# EasyEDA schematic Jafar - EasyEDA - Schematic Export.json
TITLE: Jafar Chip; REV: 5.0; Date: 09-11-2024; Sheet: 1/1; Drawn By: Tony Kuberka; Company: TK's Custom Super Modz LLC
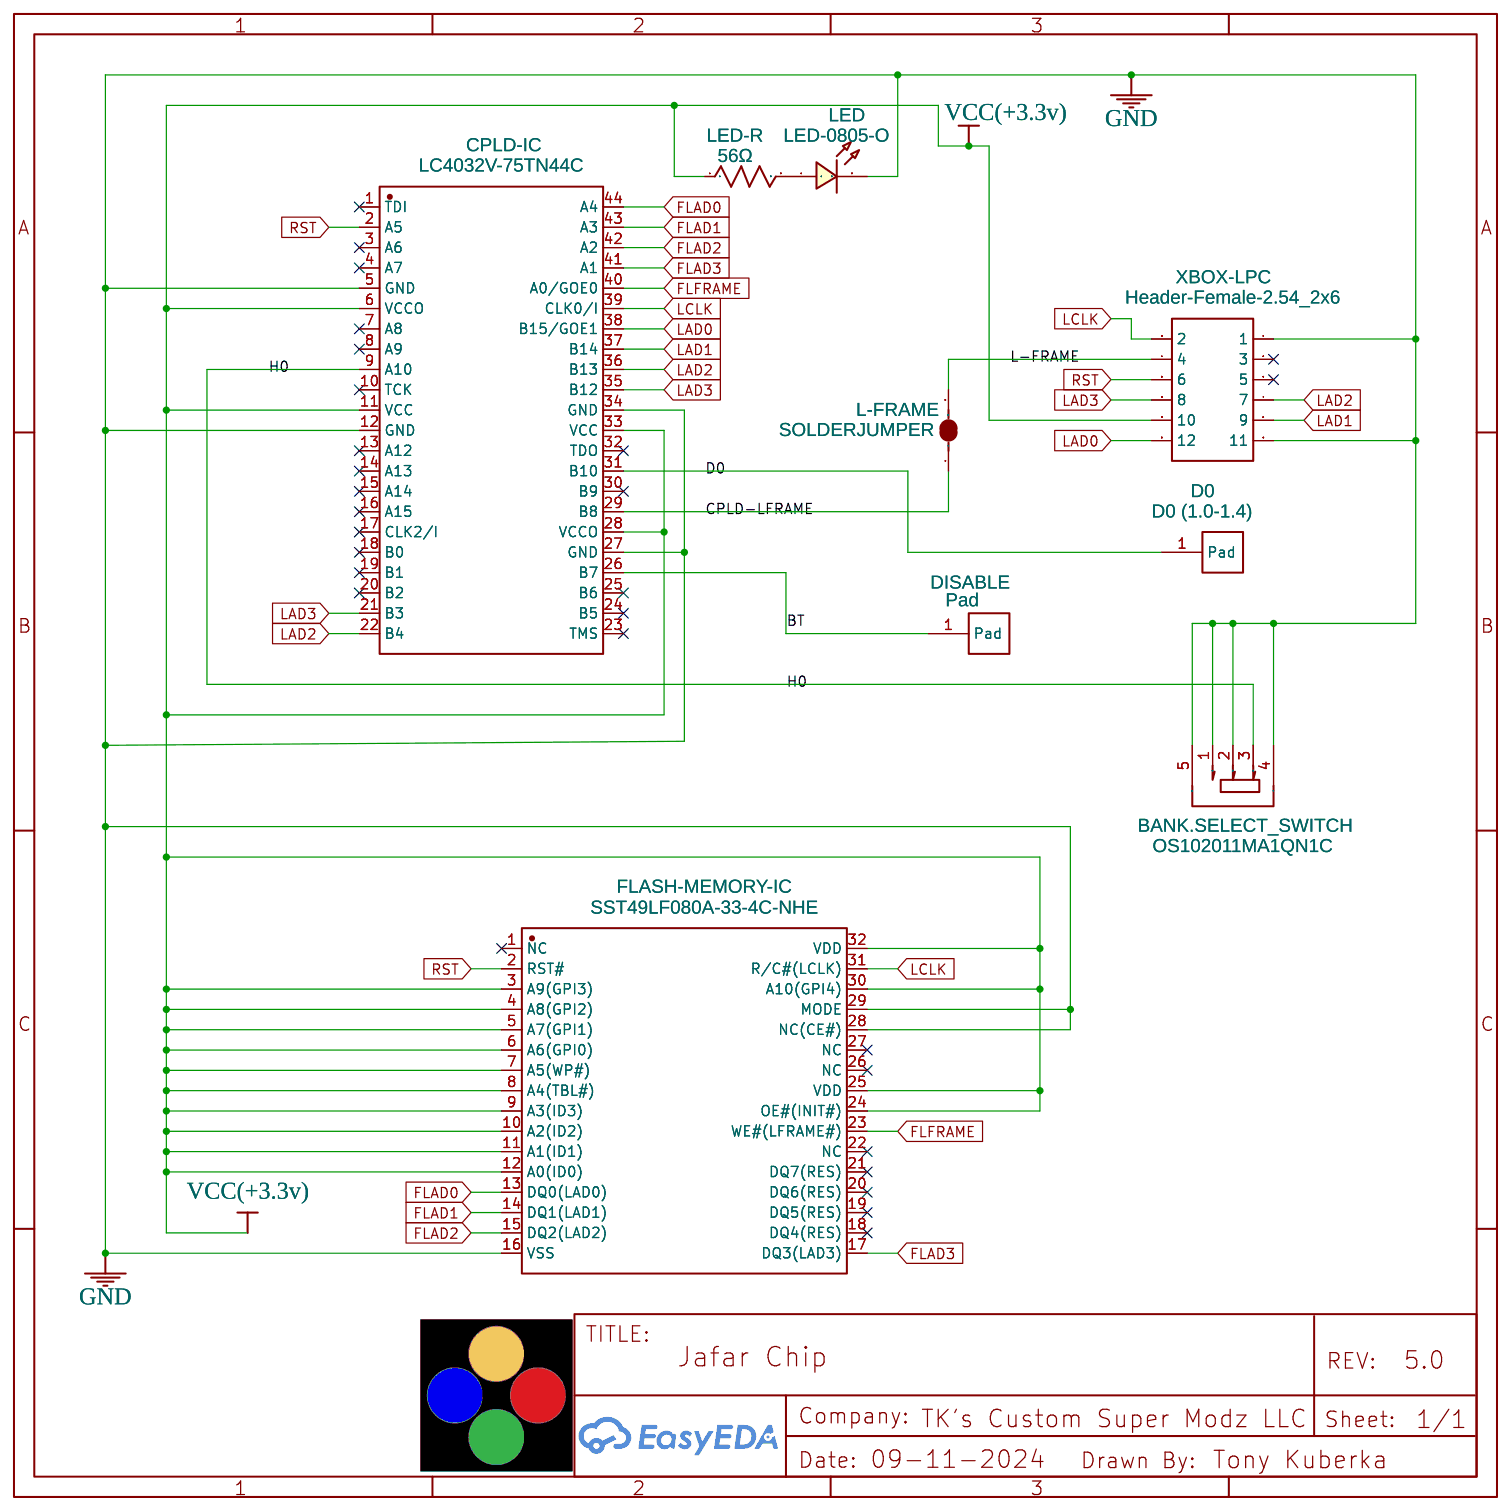
[diagram p0: schematic sheet]

## Parts
BANK.SELECT_SWITCH  OS102011MA1QN1C  [SW-TH_OS102011MA1QN1C]
CPLD-IC  LC4032V-75TN44C  [TQFP-44_L10.0-W10.0-P0.80-LS12.0-BL]
D0  D0 (1.0-1.4)  [PADPAD]
DISABLE  Pad  [PADPAD]
FLASH-MEMORY-IC  SST49LF080A-33-4C-NHE  [PLCC-32_L14.0-W11.4-P1.27-LS15.0-T]
L-FRAME  SOLDERJUMPER  [SJ_2S-NOTRACE]
LED  LED-0805-O  [LED-0805-ORANGE]
LED-R  56Ω  [R0805]
XBOX-LPC  Header-Female-2.54_2x6  [HDR-TH_12P-P2.54-V-F-R2-C6-S2.54]

## Library data of the parts
BANK.SELECT_SWITCH = OS102011MA1QN1C: Supplier: LCSC; Supplier Part: C221828; Manufacturer: C&K; Contributor: LCSC; JLCPCB Part Class: Extended Part
CPLD-IC = LC4032V-75TN44C: Supplier: LCSC; Supplier Part: C1521108; Manufacturer: LATTICE(莱迪思); Contributor: LCSC; JLCPCB Part Class: Extended Part
D0 DISABLE = SOLDER PAD: Contributor: Tellon
FLASH-MEMORY-IC = SST49LF080A-33-4C-NHE: Supplier: LCSC; Supplier Part: C645941; Manufacturer: MICROCHIP(美国微芯); link: https://atta.szlcsc.comnull; Contributor: lcsc
L-FRAME = SOLDERJUMPER-OLDNC2: Solder Jumper; Contributor: SparkFun
LED = LED-0805-ORANGE: Manufacturer: Yongyu Photoelectric; Manufacturer Part: SZYY0805O; Supplier: LCSC; Supplier Part: C434437; link: https://datasheet.lcsc.com/lcsc/1912111437_Yongyu-Photoelectric-SZYY0805O_C434437.pdf; Contributor: ajkuberka; Package Display: No
LED-R = R_0805_US: Contributor: LCEDA_Lib
XBOX-LPC = Header-Female-2.54_2x6: Supplier: LCSC; Manufacturer: BOOMELE(博穆精密); Manufacturer Part: 2.54-2*6P母; Supplier Part: C36191; JLCPCB Part Class: Extended Part

## Nets
GND: BANK.SELECT_SWITCH.1 BANK.SELECT_SWITCH.2 BANK.SELECT_SWITCH.4 BANK.SELECT_SWITCH.5 CPLD-IC.5(GND) CPLD-IC.12(GND) CPLD-IC.27(GND) CPLD-IC.34(GND) FLASH-MEMORY-IC.16(VSS) FLASH-MEMORY-IC.28(NC(CE#)) FLASH-MEMORY-IC.29(MODE) LED.2 XBOX-LPC.1 XBOX-LPC.11
VCC(+3.3v): CPLD-IC.6(VCCO) CPLD-IC.11(VCC) CPLD-IC.28(VCCO) CPLD-IC.33(VCC) FLASH-MEMORY-IC.3(A9(GPI3)) FLASH-MEMORY-IC.4(A8(GPI2)) FLASH-MEMORY-IC.5(A7(GPI1)) FLASH-MEMORY-IC.6(A6(GPI0)) FLASH-MEMORY-IC.7(A5(WP#)) FLASH-MEMORY-IC.8(A4(TBL#)) FLASH-MEMORY-IC.9(A3(ID3)) FLASH-MEMORY-IC.10(A2(ID2)) FLASH-MEMORY-IC.11(A1(ID1)) FLASH-MEMORY-IC.12(A0(ID0)) FLASH-MEMORY-IC.24(OE#(INIT#)) FLASH-MEMORY-IC.25(VDD) FLASH-MEMORY-IC.30(A10(GPI4)) FLASH-MEMORY-IC.32(VDD) LED-R.1 XBOX-LPC.10
BT: CPLD-IC.26(B7) DISABLE.1(Pad)
CPLD-LFRAME: CPLD-IC.29(B8) L-FRAME.1
D0: CPLD-IC.31(B10) D0.1(Pad)
FLAD0: CPLD-IC.44(A4) FLASH-MEMORY-IC.13(DQ0(LAD0))
FLAD1: CPLD-IC.43(A3) FLASH-MEMORY-IC.14(DQ1(LAD1))
FLAD2: CPLD-IC.42(A2) FLASH-MEMORY-IC.15(DQ2(LAD2))
FLAD3: CPLD-IC.41(A1) FLASH-MEMORY-IC.17(DQ3(LAD3))
FLFRAME: CPLD-IC.40(A0/GOE0) FLASH-MEMORY-IC.23(WE#(LFRAME#))
H0: BANK.SELECT_SWITCH.3 CPLD-IC.9(A10)
L-FRAME: L-FRAME.2 XBOX-LPC.4
LAD0: CPLD-IC.38(B15/GOE1) XBOX-LPC.12
LAD1: CPLD-IC.37(B14) XBOX-LPC.9
LAD2: CPLD-IC.22(B4) CPLD-IC.36(B13) XBOX-LPC.7
LAD3: CPLD-IC.21(B3) CPLD-IC.35(B12) XBOX-LPC.8
LCLK: CPLD-IC.39(CLK0/I) FLASH-MEMORY-IC.31(R/C#(LCLK)) XBOX-LPC.2
RST: CPLD-IC.2(A5) FLASH-MEMORY-IC.2(RST#) XBOX-LPC.6
Net-(LED-1): LED.1 LED-R.2

Not connected (* = marked no-connect by the designer): CPLD-IC 1(TDI)* 3(A6)* 4(A7)* 7(A8)* 8(A9)* 10(TCK)* 13(A12)* 14(A13)* 15(A14)* 16(A15)* 17(CLK2/I)* 18(B0)* 19(B1)* 20(B2)* 23(TMS)* 24(B5)* 25(B6)* 30(B9)* 32(TDO)*; FLASH-MEMORY-IC 1(NC)* 18(DQ4(RES))* 19(DQ5(RES))* 20(DQ6(RES))* 21(DQ7(RES))* 22(NC)* 26(NC)* 27(NC)*; XBOX-LPC 3* 5*
